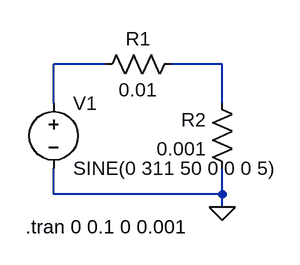
[diagram p0: schematic g2_p4.asc]
g2_p4.asc, the LTspice schematic file:
Version 4
SHEET 1 880 680
WIRE 176 96 112 96
WIRE 320 96 256 96
WIRE 112 144 112 96
WIRE 320 144 320 96
WIRE 112 256 112 224
WIRE 320 256 320 224
WIRE 320 256 112 256
WIRE 320 272 320 256
FLAG 320 272 0
SYMBOL voltage 112 128 R0
WINDOW 123 0 0 Left 0
WINDOW 39 0 0 Left 0
SYMATTR InstName V1
SYMATTR Value SINE(0 311 50 0 0 0 5)
SYMBOL res 272 80 R90
WINDOW 0 0 56 VBottom 2
WINDOW 3 32 56 VTop 2
SYMATTR InstName R1
SYMATTR Value 0.01
SYMBOL res 336 240 R180
WINDOW 0 36 76 Left 2
WINDOW 3 36 40 Left 2
SYMATTR InstName R2
SYMATTR Value 0.001
TEXT 78 296 Left 2 !.tran 0 0.1 0 0.001

The netlist it stands for:
* g2_p4.asc
V1 N001 0 SINE(0 311 50 0 0 0 5)
R1 N002 N001 0.01
R2 0 N002 0.001
.tran 0 0.1 0 0.001
.backanno
.end